# Altium schematic sheet RT_SUPER_C1.SchDoc
size D; Organization: Altium Limited; Address1: 3 Minna Close; Address2: Belrose; Address3: NSW 2085; Address4: Australia; SheetNumber: 1; SheetTotal: 1; PAGE_TITLE: -
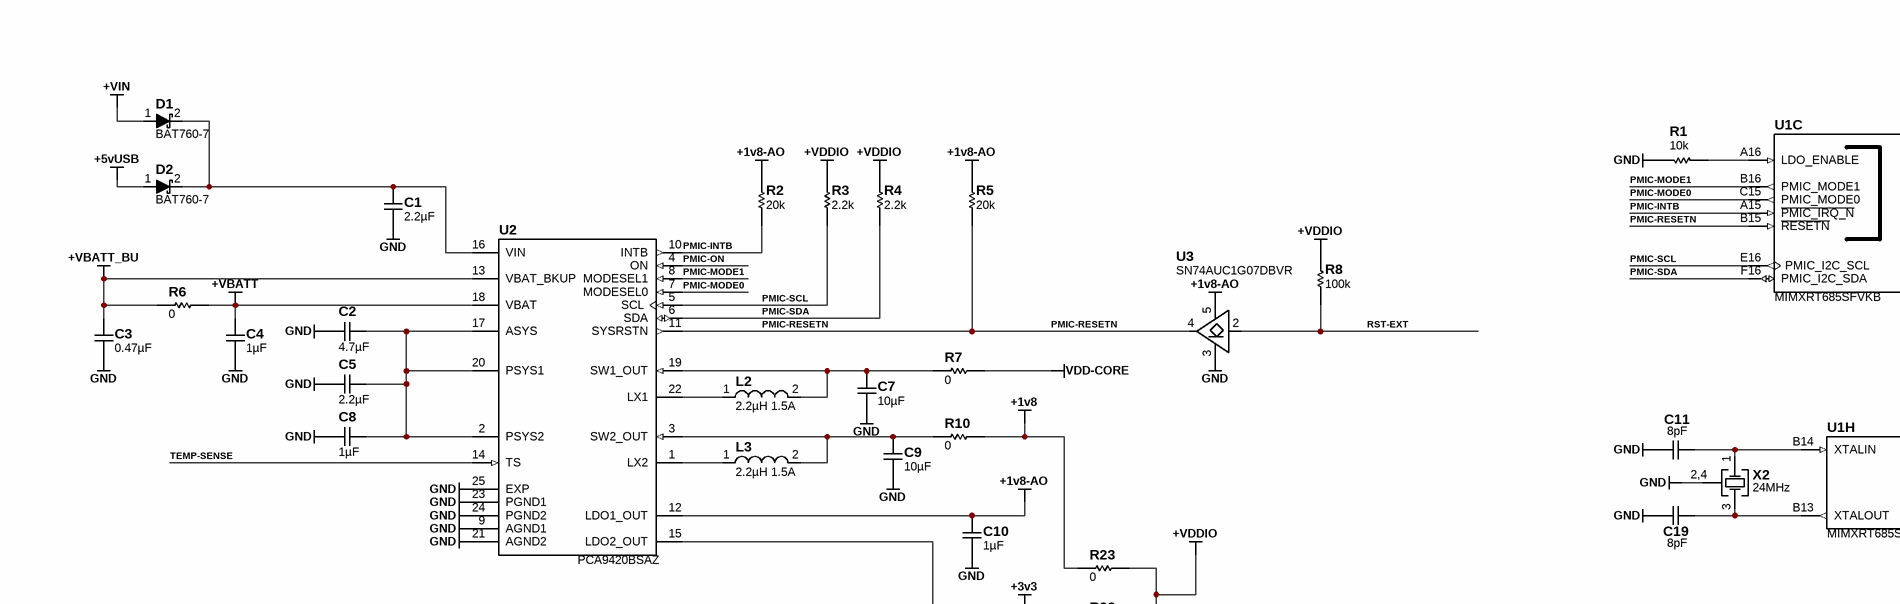
[diagram p0: RT_SUPER_C1.SchDoc, top left]
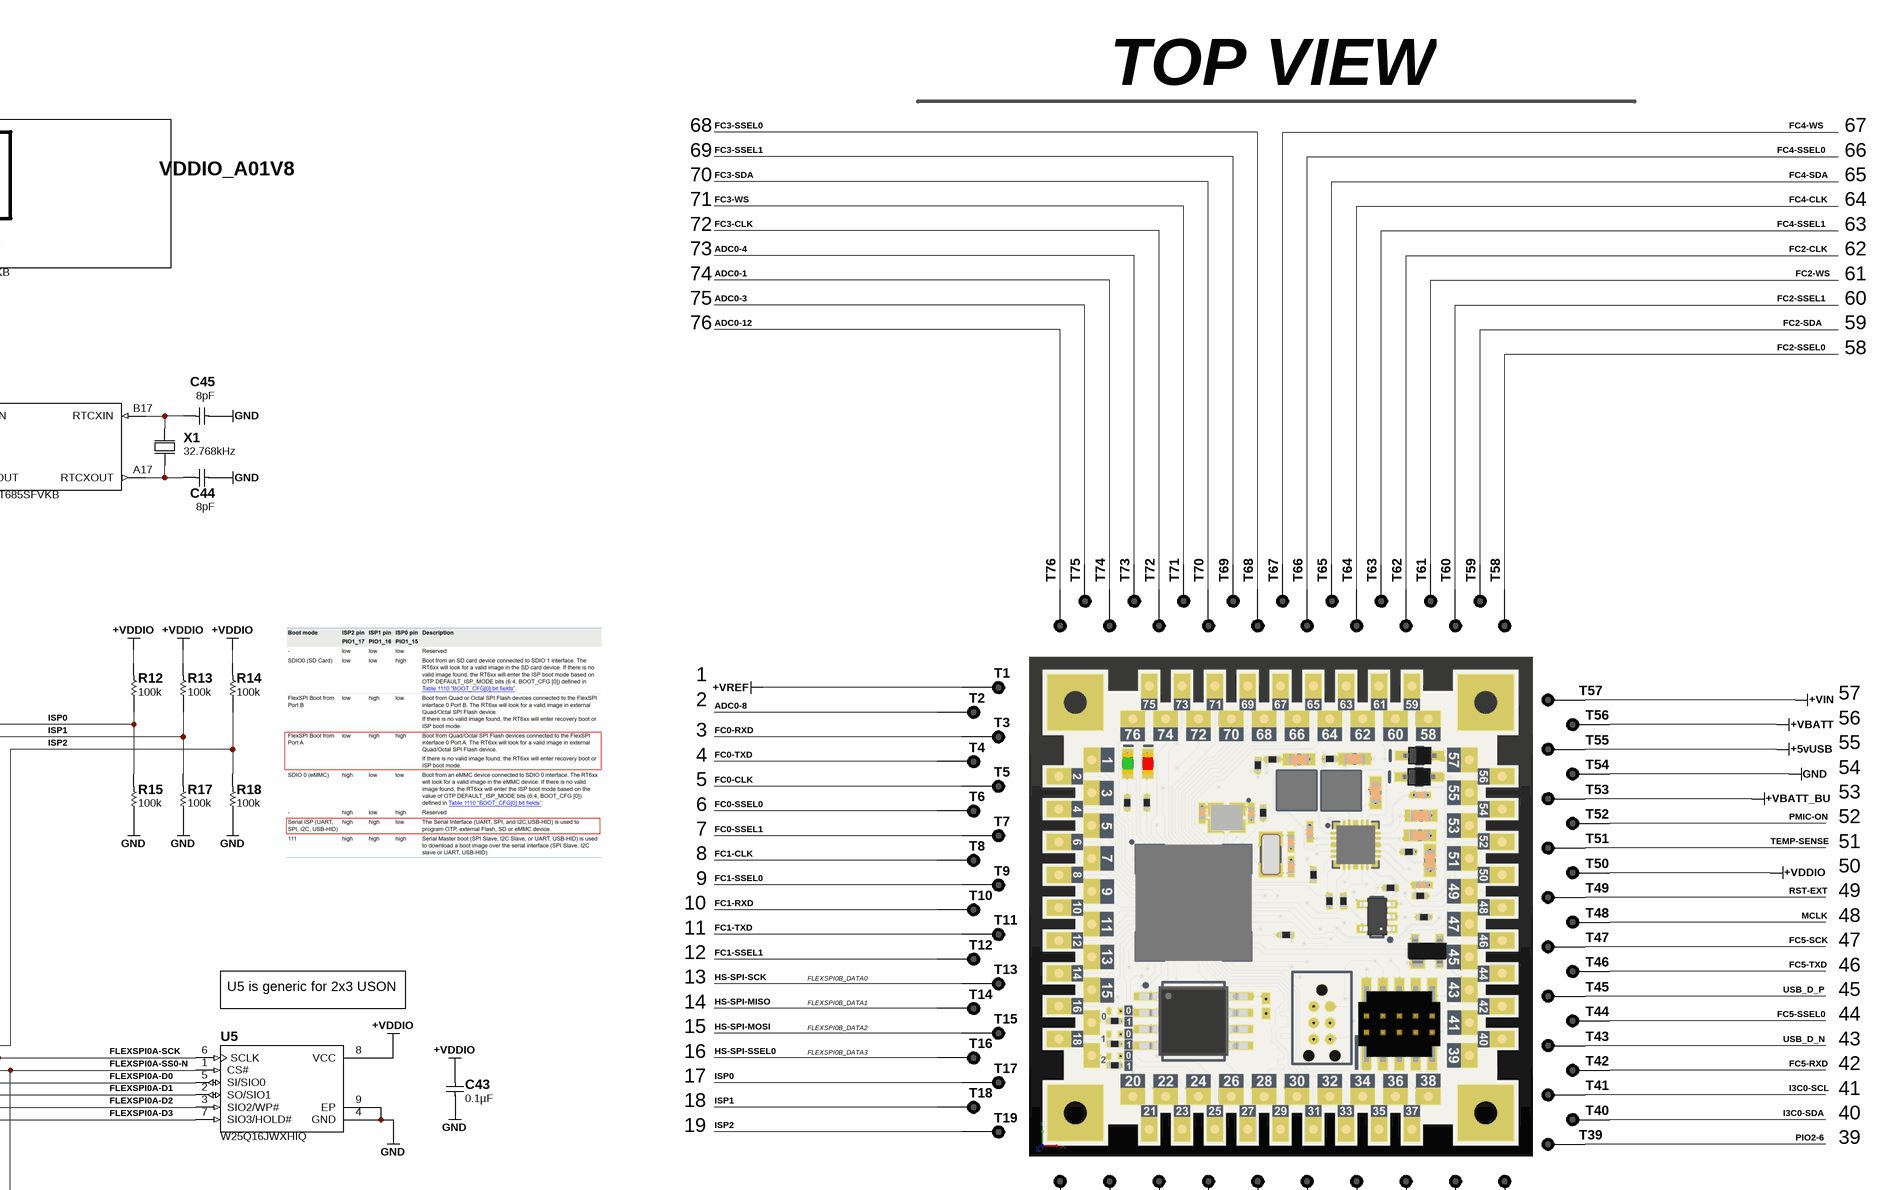
[diagram p1: RT_SUPER_C1.SchDoc, top right]
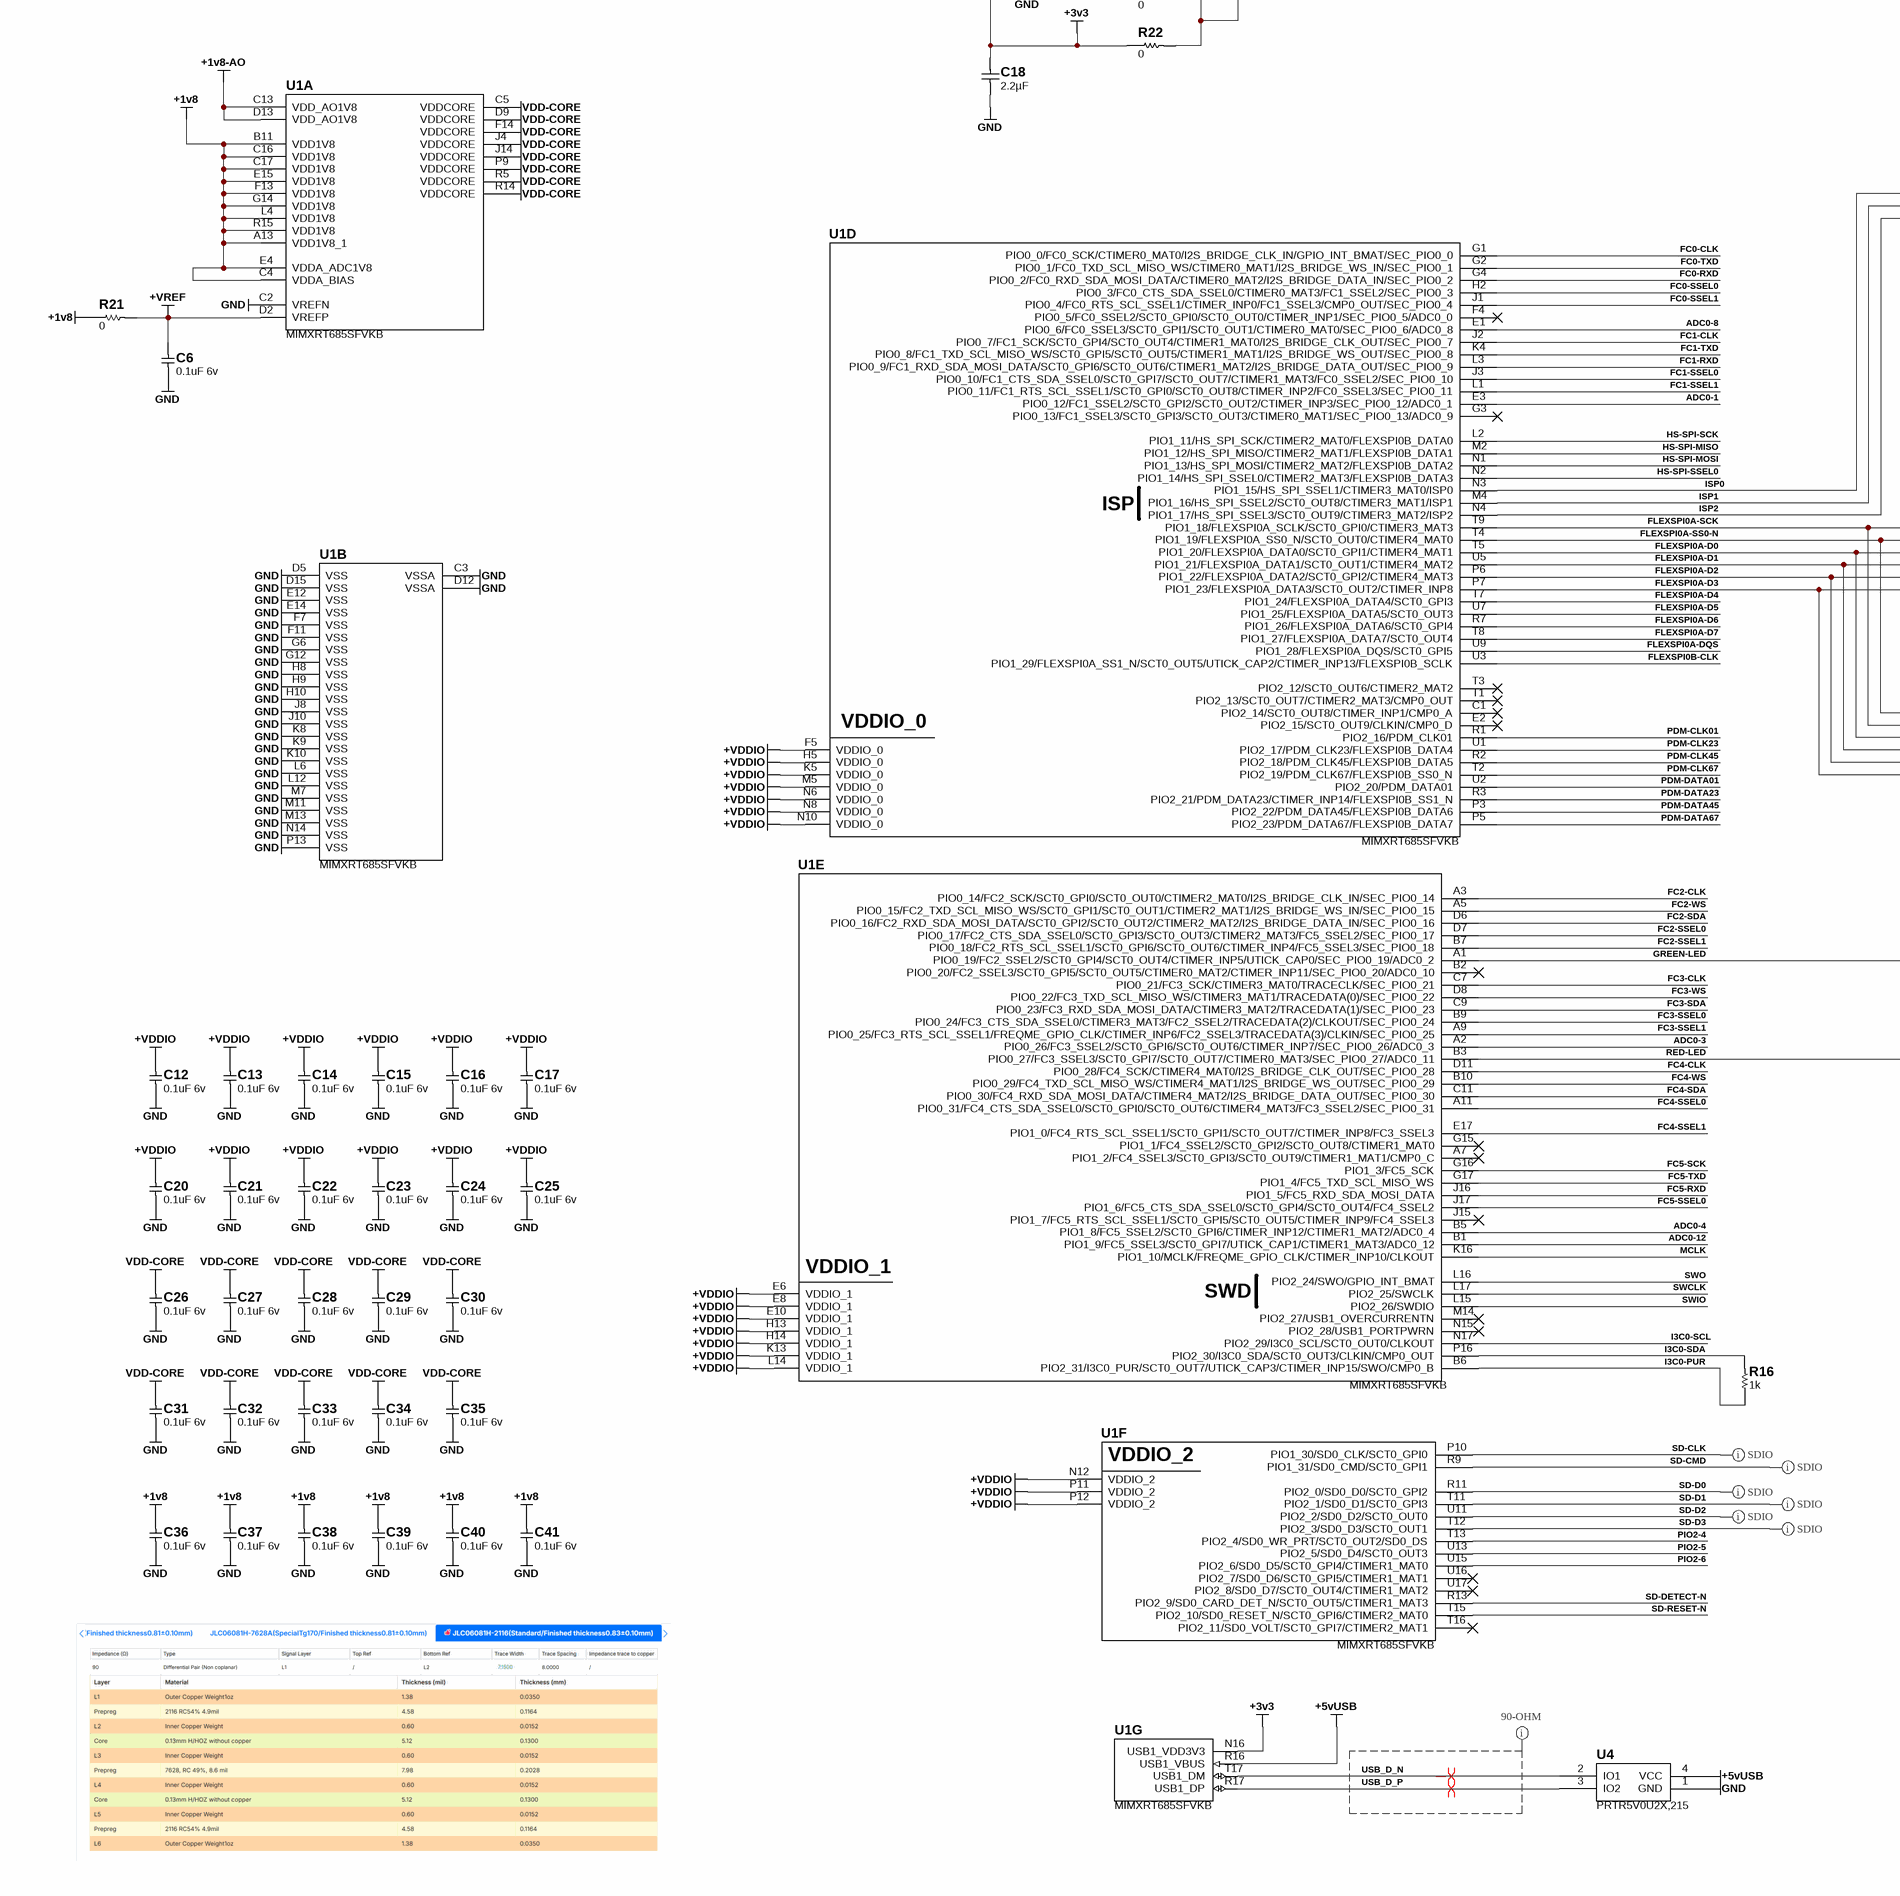
[diagram p2: RT_SUPER_C1.SchDoc, bottom left]
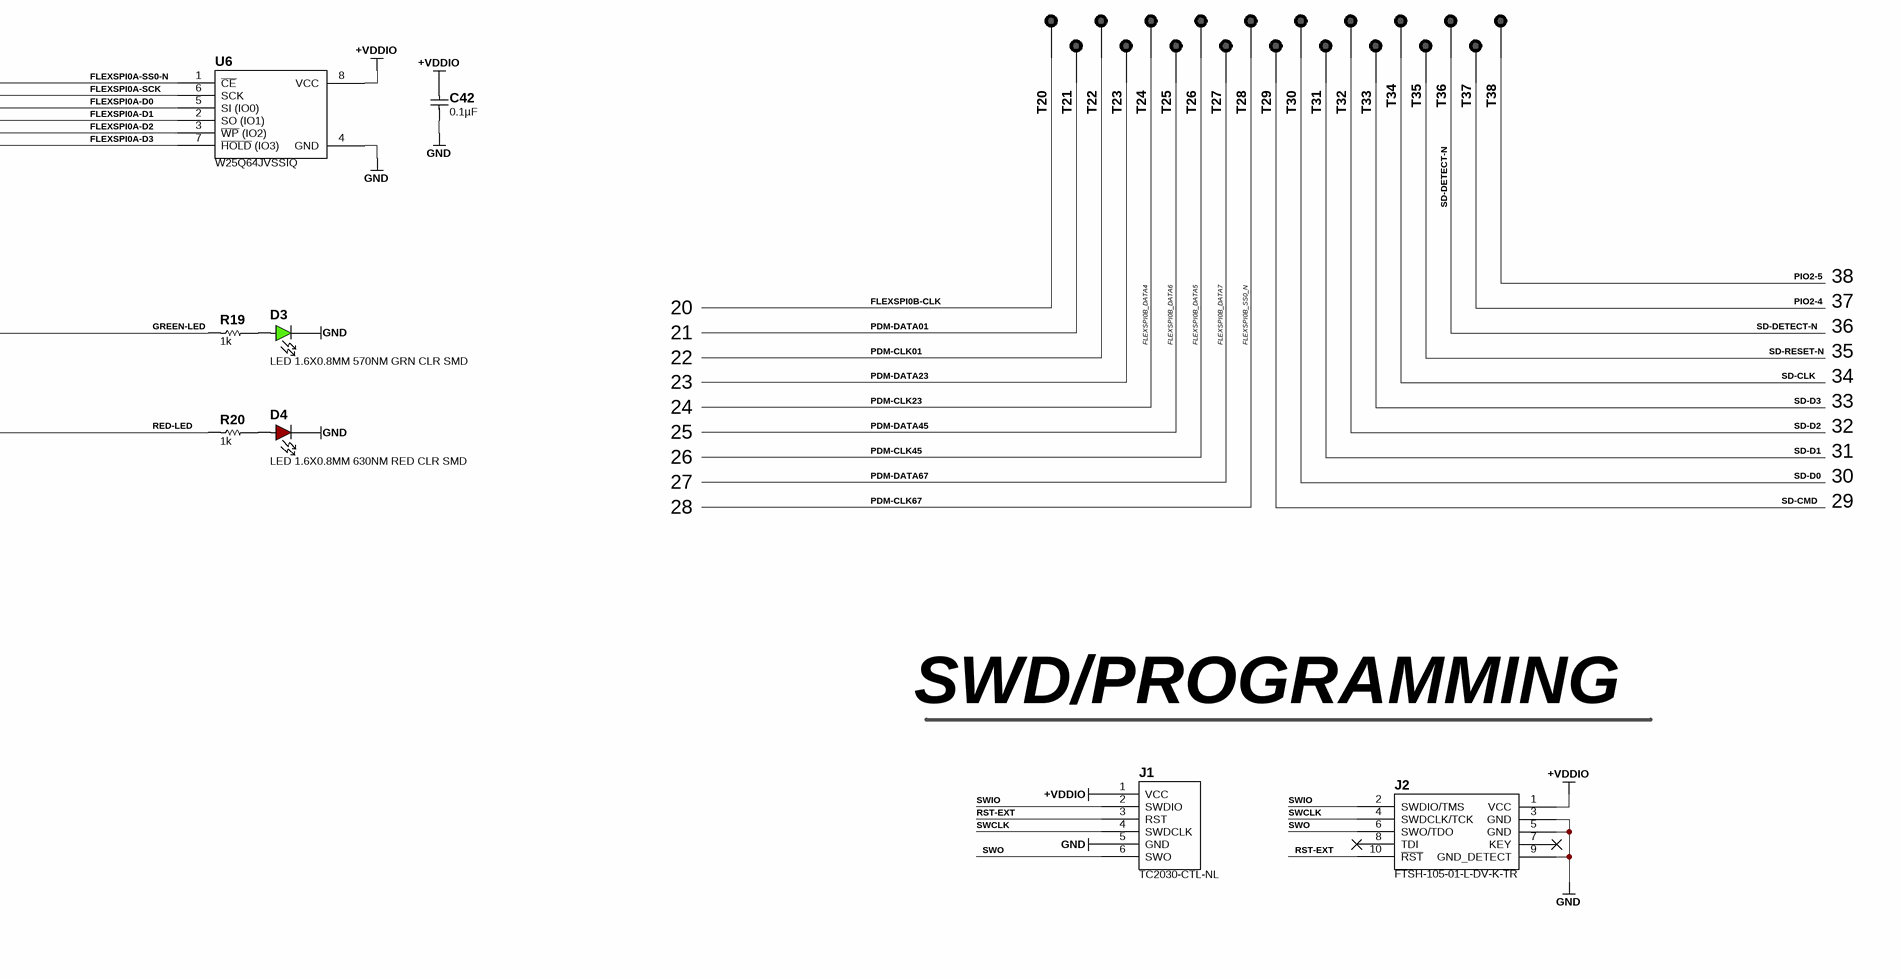
[diagram p3: RT_SUPER_C1.SchDoc, bottom right]

## Parts
C1  2.2µF  [C0603_0.90MM_MD]
C2  4.7µF  [C0603_1.00MM_MD]
C3  0.47µF  [C0402_0.55MM_HD]
C4  1µF  [C0402_0.55MM_HD]
C5  2.2µF  [C0603_0.90MM_MD]
C6  0.1uF 6v  [C0201_PERFECT]
C7  10µF  [C0603_0.90MM_MD]
C8  1µF  [C0402_0.55MM_HD]
C9  10µF  [C0603_0.90MM_MD]
C10  1µF  [C0402_0.55MM_HD]
C11  8pF  [C0402_0.55MM_HD]
C12  0.1uF 6v  [C0201_PERFECT]
C13  0.1uF 6v  [C0201_PERFECT]
C14  0.1uF 6v  [C0201_PERFECT]
C15  0.1uF 6v  [C0201_PERFECT]
C16  0.1uF 6v  [C0201_PERFECT]
C17  0.1uF 6v  [C0201_PERFECT]
C18  2.2µF  [C0603_0.90MM_MD]
C19  8pF  [C0402_0.55MM_HD]
C20  0.1uF 6v  [C0201_PERFECT]
C21  0.1uF 6v  [C0201_PERFECT]
C22  0.1uF 6v  [C0201_PERFECT]
C23  0.1uF 6v  [C0201_PERFECT]
C24  0.1uF 6v  [C0201_PERFECT]
C25  0.1uF 6v  [C0201_PERFECT]
C26  0.1uF 6v  [C0201_PERFECT]
C27  0.1uF 6v  [C0201_PERFECT]
C28  0.1uF 6v  [C0201_PERFECT]
C29  0.1uF 6v  [C0201_PERFECT]
C30  0.1uF 6v  [C0201_PERFECT]
C31  0.1uF 6v  [C0201_PERFECT]
C32  0.1uF 6v  [C0201_PERFECT]
C33  0.1uF 6v  [C0201_PERFECT]
C34  0.1uF 6v  [C0201_PERFECT]
C35  0.1uF 6v  [C0201_PERFECT]
C36  0.1uF 6v  [C0201_PERFECT]
C37  0.1uF 6v  [C0201_PERFECT]
C38  0.1uF 6v  [C0201_PERFECT]
C39  0.1uF 6v  [C0201_PERFECT]
C40  0.1uF 6v  [C0201_PERFECT]
C41  0.1uF 6v  [C0201_PERFECT]
C42  0.1µF  [C0402_0.55MM_MD]
C43  0.1µF  [C0402_0.55MM_MD]
C44  8pF  [C0402_0.55MM_HD]
C45  8pF  [C0402_0.55MM_HD]
D1  BAT760-7  [D_SOD-323_P]
D2  BAT760-7  [D_SOD-323_P]
D3  LED 1.6X0.8MM 570NM GRN CLR SMD  [LED_0603 - GREEN]
D4  LED 1.6X0.8MM 630NM RED CLR SMD  [LED_0603 - RED]
J1  TC2030‐CTL‐NL  [TC2030 NO LATCH]  (no BOM)
J2  FTSH-105-01-L-DV-K-TR  [FTSH-105-01-L-DV-K-TR]
L2  2.2µH 1.5A  [L_NRH3012]
L3  2.2µH 1.5A  [L_NRH3012]
R1  10k  [R0402_0.40MM_HD]
R2  20k  [R0402_0.40MM_HD]
R3  2.2k  [R0402_0.40MM_HD]
R4  2.2k  [R0402_0.40MM_HD]
R5  20k  [R0402_0.40MM_HD]
R6  0  [R0402_0.40MM_HD]
R7  0  [R0402_0.40MM_HD]
R8  100k  [R0402_0.40MM_HD]
R10  0  [R0402_0.40MM_HD]
R12  100k  [R0402_0.40MM_HD]
R13  100k  [R0402_0.40MM_HD]
R14  100k  [R0402_0.40MM_HD]
R15  100k  [R0402_0.40MM_HD]
R16  1k  [R0402_0.40MM_HD]
R17  100k  [R0402_0.40MM_HD]
R18  100k  [R0402_0.40MM_HD]
R19  1k  [R0402_0.40MM_HD]
R20  1k  [R0402_0.40MM_HD]
R21  0  [R0402_0.40MM_HD]
R22  0  [R0402_0.40MM_HD]
R23  0  [R0402_0.40MM_HD]
T1  SOLDER_HOLE  [MACHINE_PIN_SOLDERHOLE]  (value not drawn)  (no BOM)
T2  SOLDER_HOLE  [MACHINE_PIN_SOLDERHOLE]  (value not drawn)  (no BOM)
T3  SOLDER_HOLE  [MACHINE_PIN_SOLDERHOLE]  (value not drawn)  (no BOM)
T4  SOLDER_HOLE  [MACHINE_PIN_SOLDERHOLE]  (value not drawn)  (no BOM)
T5  SOLDER_HOLE  [MACHINE_PIN_SOLDERHOLE]  (value not drawn)  (no BOM)
T6  SOLDER_HOLE  [MACHINE_PIN_SOLDERHOLE]  (value not drawn)  (no BOM)
T7  SOLDER_HOLE  [MACHINE_PIN_SOLDERHOLE]  (value not drawn)  (no BOM)
T8  SOLDER_HOLE  [MACHINE_PIN_SOLDERHOLE]  (value not drawn)  (no BOM)
T9  SOLDER_HOLE  [MACHINE_PIN_SOLDERHOLE]  (value not drawn)  (no BOM)
T10  SOLDER_HOLE  [MACHINE_PIN_SOLDERHOLE]  (value not drawn)  (no BOM)
T11  SOLDER_HOLE  [MACHINE_PIN_SOLDERHOLE]  (value not drawn)  (no BOM)
T12  SOLDER_HOLE  [MACHINE_PIN_SOLDERHOLE]  (value not drawn)  (no BOM)
T13  SOLDER_HOLE  [MACHINE_PIN_SOLDERHOLE]  (value not drawn)  (no BOM)
T14  SOLDER_HOLE  [MACHINE_PIN_SOLDERHOLE]  (value not drawn)  (no BOM)
T15  SOLDER_HOLE  [MACHINE_PIN_SOLDERHOLE]  (value not drawn)  (no BOM)
T16  SOLDER_HOLE  [MACHINE_PIN_SOLDERHOLE]  (value not drawn)  (no BOM)
T17  SOLDER_HOLE  [MACHINE_PIN_SOLDERHOLE]  (value not drawn)  (no BOM)
T18  SOLDER_HOLE  [MACHINE_PIN_SOLDERHOLE]  (value not drawn)  (no BOM)
T19  SOLDER_HOLE  [MACHINE_PIN_SOLDERHOLE]  (value not drawn)  (no BOM)
T20  SOLDER_HOLE  [MACHINE_PIN_SOLDERHOLE]  (value not drawn)  (no BOM)
T21  SOLDER_HOLE  [MACHINE_PIN_SOLDERHOLE]  (value not drawn)  (no BOM)
T22  SOLDER_HOLE  [MACHINE_PIN_SOLDERHOLE]  (value not drawn)  (no BOM)
T23  SOLDER_HOLE  [MACHINE_PIN_SOLDERHOLE]  (value not drawn)  (no BOM)
T24  SOLDER_HOLE  [MACHINE_PIN_SOLDERHOLE]  (value not drawn)  (no BOM)
T25  SOLDER_HOLE  [MACHINE_PIN_SOLDERHOLE]  (value not drawn)  (no BOM)
T26  SOLDER_HOLE  [MACHINE_PIN_SOLDERHOLE]  (value not drawn)  (no BOM)
T27  SOLDER_HOLE  [MACHINE_PIN_SOLDERHOLE]  (value not drawn)  (no BOM)
T28  SOLDER_HOLE  [MACHINE_PIN_SOLDERHOLE]  (value not drawn)  (no BOM)
T29  SOLDER_HOLE  [MACHINE_PIN_SOLDERHOLE]  (value not drawn)  (no BOM)
T30  SOLDER_HOLE  [MACHINE_PIN_SOLDERHOLE]  (value not drawn)  (no BOM)
T31  SOLDER_HOLE  [MACHINE_PIN_SOLDERHOLE]  (value not drawn)  (no BOM)
T32  SOLDER_HOLE  [MACHINE_PIN_SOLDERHOLE]  (value not drawn)  (no BOM)
T33  SOLDER_HOLE  [MACHINE_PIN_SOLDERHOLE]  (value not drawn)  (no BOM)
T34  SOLDER_HOLE  [MACHINE_PIN_SOLDERHOLE]  (value not drawn)  (no BOM)
T35  SOLDER_HOLE  [MACHINE_PIN_SOLDERHOLE]  (value not drawn)  (no BOM)
T36  SOLDER_HOLE  [MACHINE_PIN_SOLDERHOLE]  (value not drawn)  (no BOM)
T37  SOLDER_HOLE  [MACHINE_PIN_SOLDERHOLE]  (value not drawn)  (no BOM)
T38  SOLDER_HOLE  [MACHINE_PIN_SOLDERHOLE]  (value not drawn)  (no BOM)
T39  SOLDER_HOLE  [MACHINE_PIN_SOLDERHOLE]  (value not drawn)  (no BOM)
T40  SOLDER_HOLE  [MACHINE_PIN_SOLDERHOLE]  (value not drawn)  (no BOM)
T41  SOLDER_HOLE  [MACHINE_PIN_SOLDERHOLE]  (value not drawn)  (no BOM)
T42  SOLDER_HOLE  [MACHINE_PIN_SOLDERHOLE]  (value not drawn)  (no BOM)
T43  SOLDER_HOLE  [MACHINE_PIN_SOLDERHOLE]  (value not drawn)  (no BOM)
T44  SOLDER_HOLE  [MACHINE_PIN_SOLDERHOLE]  (value not drawn)  (no BOM)
T45  SOLDER_HOLE  [MACHINE_PIN_SOLDERHOLE]  (value not drawn)  (no BOM)
T46  SOLDER_HOLE  [MACHINE_PIN_SOLDERHOLE]  (value not drawn)  (no BOM)
T47  SOLDER_HOLE  [MACHINE_PIN_SOLDERHOLE]  (value not drawn)  (no BOM)
T48  SOLDER_HOLE  [MACHINE_PIN_SOLDERHOLE]  (value not drawn)  (no BOM)
T49  SOLDER_HOLE  [MACHINE_PIN_SOLDERHOLE]  (value not drawn)  (no BOM)
T50  SOLDER_HOLE  [MACHINE_PIN_SOLDERHOLE]  (value not drawn)  (no BOM)
T51  SOLDER_HOLE  [MACHINE_PIN_SOLDERHOLE]  (value not drawn)  (no BOM)
T52  SOLDER_HOLE  [MACHINE_PIN_SOLDERHOLE]  (value not drawn)  (no BOM)
T53  SOLDER_HOLE  [MACHINE_PIN_SOLDERHOLE]  (value not drawn)  (no BOM)
T54  SOLDER_HOLE  [MACHINE_PIN_SOLDERHOLE]  (value not drawn)  (no BOM)
T55  SOLDER_HOLE  [MACHINE_PIN_SOLDERHOLE]  (value not drawn)  (no BOM)
T56  SOLDER_HOLE  [MACHINE_PIN_SOLDERHOLE]  (value not drawn)  (no BOM)
T57  SOLDER_HOLE  [MACHINE_PIN_SOLDERHOLE]  (value not drawn)  (no BOM)
T58  SOLDER_HOLE  [MACHINE_PIN_SOLDERHOLE]  (value not drawn)  (no BOM)
T59  SOLDER_HOLE  [MACHINE_PIN_SOLDERHOLE]  (value not drawn)  (no BOM)
T60  SOLDER_HOLE  [MACHINE_PIN_SOLDERHOLE]  (value not drawn)  (no BOM)
T61  SOLDER_HOLE  [MACHINE_PIN_SOLDERHOLE]  (value not drawn)  (no BOM)
T62  SOLDER_HOLE  [MACHINE_PIN_SOLDERHOLE]  (value not drawn)  (no BOM)
T63  SOLDER_HOLE  [MACHINE_PIN_SOLDERHOLE]  (value not drawn)  (no BOM)
T64  SOLDER_HOLE  [MACHINE_PIN_SOLDERHOLE]  (value not drawn)  (no BOM)
T65  SOLDER_HOLE  [MACHINE_PIN_SOLDERHOLE]  (value not drawn)  (no BOM)
T66  SOLDER_HOLE  [MACHINE_PIN_SOLDERHOLE]  (value not drawn)  (no BOM)
T67  SOLDER_HOLE  [MACHINE_PIN_SOLDERHOLE]  (value not drawn)  (no BOM)
T68  SOLDER_HOLE  [MACHINE_PIN_SOLDERHOLE]  (value not drawn)  (no BOM)
T69  SOLDER_HOLE  [MACHINE_PIN_SOLDERHOLE]  (value not drawn)  (no BOM)
T70  SOLDER_HOLE  [MACHINE_PIN_SOLDERHOLE]  (value not drawn)  (no BOM)
T71  SOLDER_HOLE  [MACHINE_PIN_SOLDERHOLE]  (value not drawn)  (no BOM)
T72  SOLDER_HOLE  [MACHINE_PIN_SOLDERHOLE]  (value not drawn)  (no BOM)
T73  SOLDER_HOLE  [MACHINE_PIN_SOLDERHOLE]  (value not drawn)  (no BOM)
T74  SOLDER_HOLE  [MACHINE_PIN_SOLDERHOLE]  (value not drawn)  (no BOM)
T75  SOLDER_HOLE  [MACHINE_PIN_SOLDERHOLE]  (value not drawn)  (no BOM)
T76  SOLDER_HOLE  [MACHINE_PIN_SOLDERHOLE]  (value not drawn)  (no BOM)
U1  MIMXRT685SFVKB  [VFBGA176]  (parts A,B,C,D,E,F,G,H of 8)
U2  PCA9420BSAZ  [PCA9420]
U3  SN74AUC1G07DBVR  [SOT23-5]
U4  PRTR5V0U2X,215  [SOT143B]
U5  W25Q16JWXHIQ  [W25Q_XSON_8]
U6  W25Q64JVSSIQ  [SOIC127P830X200-8L]
X1  32.768kHz  [XTAL_3215]
X2  24MHz  [XTAL-2.5x2.0mm]

## Nets
+1v8: C36.2 C37.2 C38.2 C39.2 C40.2 C41.2 R10.2 R21.1 R23.1 U1.A13(VDD1V8_1) U1.B11(VDD1V8) U1.C4(VDDA_BIAS) U1.C16(VDD1V8) U1.C17(VDD1V8) U1.E4(VDDA_ADC1V8) U1.E15(VDD1V8) U1.F13(VDD1V8) U1.G14(VDD1V8) U1.L4(VDD1V8) U1.R15(VDD1V8)
+1v8-AO: C10.2 R2.2 R5.2 U1.C13(VDD_AO1V8) U1.D13(VDD_AO1V8) U2.12(LDO1_OUT) U3.5(VCC)
+3v3: C18.2 R22.1 U1.N16(USB1_VDD3V3) U2.15(LDO2_OUT)
+5vUSB: D2.1(A) T55.1 U1.R16(USB1_VBUS) U4.4(VCC)
+VBATT: C4.2 R6.2 T56.1 U2.18(VBAT)
+VBATT_BU: C3.2 R6.1 T53.1 U2.13(VBAT_BKUP)
+VDDIO: C12.2 C13.2 C14.2 C15.2 C16.2 C17.2 C20.2 C21.2 C22.2 C23.2 C24.2 C25.2 C42.1 C43.1 J1.1(VCC) J2.1(VCC) R3.2 R4.2 R8.2 R12.2 R13.2 R14.2 R22.2 R23.2 T50.1 U1.E6(VDDIO_1) U1.E8(VDDIO_1) U1.E10(VDDIO_1) U1.F5(VDDIO_0) U1.H5(VDDIO_0) U1.H13(VDDIO_1) U1.H14(VDDIO_1) U1.K5(VDDIO_0) U1.K13(VDDIO_1) U1.L14(VDDIO_1) U1.M5(VDDIO_0) U1.N6(VDDIO_0) U1.N8(VDDIO_0) U1.N10(VDDIO_0) U1.N12(VDDIO_2) U1.P11(VDDIO_2) U1.P12(VDDIO_2) U5.8(VCC) U6.8(VCC)
+VIN: D1.1(A) T57.1
+VREF: C6.2 R21.2 T1.1 U1.D2(VREFP)
GND: C1.1 C2.2 C3.1 C4.1 C5.2 C6.1 C7.1 C8.2 C9.1 C10.1 C11.1 C12.1 C13.1 C14.1 C15.1 C16.1 C17.1 C18.1 C19.1 C20.1 C21.1 C22.1 C23.1 C24.1 C25.1 C26.1 C27.1 C28.1 C29.1 C30.1 C31.1 C32.1 C33.1 C34.1 C35.1 C36.1 C37.1 C38.1 C39.1 C40.1 C41.1 C42.2 C43.2 C44.2 C45.2 D3.C D4.C J1.5(GND) J2.3(GND) J2.5(GND) J2.9(GND_DETECT) R1.1 R15.1 R17.1 R18.1 T54.1 U1.C2(VREFN) U1.C3(VSSA) U1.D5(VSS) U1.D12(VSSA) U1.D15(VSS) U1.E12(VSS) U1.E14(VSS) U1.F7(VSS) U1.F11(VSS) U1.G6(VSS) U1.G12(VSS) U1.H8(VSS) U1.H9(VSS) U1.H10(VSS) U1.J8(VSS) U1.J10(VSS) U1.K8(VSS) U1.K9(VSS) U1.K10(VSS) U1.L6(VSS) U1.L12(VSS) U1.M7(VSS) U1.M11(VSS) U1.M13(VSS) U1.N14(VSS) U1.P13(VSS) U2.9(AGND1) U2.21(AGND2) U2.23(PGND1) U2.24(PGND2) U2.25(EXP) U3.3(GND) U4.1(GND) U5.4(GND) U5.9(EP) U6.4(GND) X2.2,4(OSC1)
VDD-CORE: C26.2 C27.2 C28.2 C29.2 C30.2 C31.2 C32.2 C33.2 C34.2 C35.2 R7.2 U1.C5(VDDCORE) U1.D9(VDDCORE) U1.F14(VDDCORE) U1.J4(VDDCORE) U1.J14(VDDCORE) U1.P9(VDDCORE) U1.R5(VDDCORE) U1.R14(VDDCORE)
ADC0-1: T74.1 U1.E3(PIO0_12/FC1_SSEL2/SCT0_GPI2/SCT0_OUT2/CTIMER_INP3/SEC_PIO0_12/ADC0_1)
ADC0-3: T75.1 U1.A2(PIO0_26/FC3_SSEL2/SCT0_GPI6/SCT0_OUT6/CTIMER_INP7/SEC_PIO0_26/ADC0_3)
ADC0-4: T73.1 U1.B5(PIO1_8/FC5_SSEL2/SCT0_GPI6/CTIMER_INP12/CTIMER1_MAT2/ADC0_4)
ADC0-8: T2.1 U1.E1(PIO0_6/FC0_SSEL3/SCT0_GPI1/SCT0_OUT1/CTIMER0_MAT0/SEC_PIO0_6/ADC0_8)
ADC0-12: T76.1 U1.B1(PIO1_9/FC5_SSEL3/SCT0_GPI7/UTICK_CAP1/CTIMER1_MAT3/ADC0_12)
FC0-CLK: T5.1 U1.G1(PIO0_0/FC0_SCK/CTIMER0_MAT0/I2S_BRIDGE_CLK_IN/GPIO_INT_BMAT/SEC_PIO0_0)
FC0-RXD: T3.1 U1.G4(PIO0_2/FC0_RXD_SDA_MOSI_DATA/CTIMER0_MAT2/I2S_BRIDGE_DATA_IN/SEC_PIO0_2)
FC0-SSEL0: T6.1 U1.H2(PIO0_3/FC0_CTS_SDA_SSEL0/CTIMER0_MAT3/FC1_SSEL2/SEC_PIO0_3)
FC0-SSEL1: T7.1 U1.J1(PIO0_4/FC0_RTS_SCL_SSEL1/CTIMER_INP0/FC1_SSEL3/CMP0_OUT/SEC_PIO0_4)
FC0-TXD: T4.1 U1.G2(PIO0_1/FC0_TXD_SCL_MISO_WS/CTIMER0_MAT1/I2S_BRIDGE_WS_IN/SEC_PIO0_1)
FC1-CLK: T8.1 U1.J2(PIO0_7/FC1_SCK/SCT0_GPI4/SCT0_OUT4/CTIMER1_MAT0/I2S_BRIDGE_CLK_OUT/SEC_PIO0_7)
FC1-RXD: T10.1 U1.L3(PIO0_9/FC1_RXD_SDA_MOSI_DATA/SCT0_GPI6/SCT0_OUT6/CTIMER1_MAT2/I2S_BRIDGE_DATA_OUT/SEC_PIO0_9)
FC1-SSEL0: T9.1 U1.J3(PIO0_10/FC1_CTS_SDA_SSEL0/SCT0_GPI7/SCT0_OUT7/CTIMER1_MAT3/FC0_SSEL2/SEC_PIO0_10)
FC1-SSEL1: T12.1 U1.L1(PIO0_11/FC1_RTS_SCL_SSEL1/SCT0_GPI0/SCT0_OUT8/CTIMER_INP2/FC0_SSEL3/SEC_PIO0_11)
FC1-TXD: T11.1 U1.K4(PIO0_8/FC1_TXD_SCL_MISO_WS/SCT0_GPI5/SCT0_OUT5/CTIMER1_MAT1/I2S_BRIDGE_WS_OUT/SEC_PIO0_8)
FC2-CLK: T62.1 U1.A3(PIO0_14/FC2_SCK/SCT0_GPI0/SCT0_OUT0/CTIMER2_MAT0/I2S_BRIDGE_CLK_IN/SEC_PIO0_14)
FC2-SDA: T59.1 U1.D6(PIO0_16/FC2_RXD_SDA_MOSI_DATA/SCT0_GPI2/SCT0_OUT2/CTIMER2_MAT2/I2S_BRIDGE_DATA_IN/SEC_PIO0_16)
FC2-SSEL0: T58.1 U1.D7(PIO0_17/FC2_CTS_SDA_SSEL0/SCT0_GPI3/SCT0_OUT3/CTIMER2_MAT3/FC5_SSEL2/SEC_PIO0_17)
FC2-SSEL1: T60.1 U1.B7(PIO0_18/FC2_RTS_SCL_SSEL1/SCT0_GPI6/SCT0_OUT6/CTIMER_INP4/FC5_SSEL3/SEC_PIO0_18)
FC2-WS: T61.1 U1.A5(PIO0_15/FC2_TXD_SCL_MISO_WS/SCT0_GPI1/SCT0_OUT1/CTIMER2_MAT1/I2S_BRIDGE_WS_IN/SEC_PIO0_15)
FC3-CLK: T72.1 U1.C7(PIO0_21/FC3_SCK/CTIMER3_MAT0/TRACECLK/SEC_PIO0_21)
FC3-SDA: T70.1 U1.C9(PIO0_23/FC3_RXD_SDA_MOSI_DATA/CTIMER3_MAT2/TRACEDATA(1)/SEC_PIO0_23)
FC3-SSEL0: T68.1 U1.B9(PIO0_24/FC3_CTS_SDA_SSEL0/CTIMER3_MAT3/FC2_SSEL2/TRACEDATA(2)/CLKOUT/SEC_PIO0_24)
FC3-SSEL1: T69.1 U1.A9(PIO0_25/FC3_RTS_SCL_SSEL1/FREQME_GPIO_CLK/CTIMER_INP6/FC2_SSEL3/TRACEDATA(3)/CLKIN/SEC_PIO0_25)
FC3-WS: T71.1 U1.D8(PIO0_22/FC3_TXD_SCL_MISO_WS/CTIMER3_MAT1/TRACEDATA(0)/SEC_PIO0_22)
FC4-CLK: T64.1 U1.D11(PIO0_28/FC4_SCK/CTIMER4_MAT0/I2S_BRIDGE_CLK_OUT/SEC_PIO0_28)
FC4-SDA: T65.1 U1.C11(PIO0_30/FC4_RXD_SDA_MOSI_DATA/CTIMER4_MAT2/I2S_BRIDGE_DATA_OUT/SEC_PIO0_30)
FC4-SSEL0: T66.1 U1.A11(PIO0_31/FC4_CTS_SDA_SSEL0/SCT0_GPI0/SCT0_OUT6/CTIMER4_MAT3/FC3_SSEL2/SEC_PIO0_31)
FC4-SSEL1: T63.1 U1.E17(PIO1_0/FC4_RTS_SCL_SSEL1/SCT0_GPI1/SCT0_OUT7/CTIMER_INP8/FC3_SSEL3)
FC4-WS: T67.1 U1.B10(PIO0_29/FC4_TXD_SCL_MISO_WS/CTIMER4_MAT1/I2S_BRIDGE_WS_OUT/SEC_PIO0_29)
FC5-RXD: T42.1 U1.J16(PIO1_5/FC5_RXD_SDA_MOSI_DATA)
FC5-SCK: T47.1 U1.G16(PIO1_3/FC5_SCK)
FC5-SSEL0: T44.1 U1.J17(PIO1_6/FC5_CTS_SDA_SSEL0/SCT0_GPI4/SCT0_OUT4/FC4_SSEL2)
FC5-TXD: T46.1 U1.G17(PIO1_4/FC5_TXD_SCL_MISO_WS)
FLEXSPI0A-D0: U1.T5(PIO1_20/FLEXSPI0A_DATA0/SCT0_GPI1/CTIMER4_MAT1) U5.5(SI/SIO0) U6.5(SI_(IO0))
FLEXSPI0A-D1: U1.U5(PIO1_21/FLEXSPI0A_DATA1/SCT0_OUT1/CTIMER4_MAT2) U5.2(SO/SIO1) U6.2(SO_(IO1))
FLEXSPI0A-D2: U1.P6(PIO1_22/FLEXSPI0A_DATA2/SCT0_GPI2/CTIMER4_MAT3) U5.3(SIO2/WP#) U6.3(~{WP}_(IO2))
FLEXSPI0A-D3: U1.P7(PIO1_23/FLEXSPI0A_DATA3/SCT0_OUT2/CTIMER_INP8) U5.7(SIO3/HOLD#) U6.7(~{HOLD}_(IO3))
FLEXSPI0A-D4: U1.T7(PIO1_24/FLEXSPI0A_DATA4/SCT0_GPI3)
FLEXSPI0A-D5: U1.U7(PIO1_25/FLEXSPI0A_DATA5/SCT0_OUT3)
FLEXSPI0A-D6: U1.R7(PIO1_26/FLEXSPI0A_DATA6/SCT0_GPI4)
FLEXSPI0A-D7: U1.T8(PIO1_27/FLEXSPI0A_DATA7/SCT0_OUT4)
FLEXSPI0A-DQS: U1.U9(PIO1_28/FLEXSPI0A_DQS/SCT0_GPI5)
FLEXSPI0A-SCK: U1.T9(PIO1_18/FLEXSPI0A_SCLK/SCT0_GPI0/CTIMER3_MAT3) U5.6(SCLK) U6.6(SCK)
FLEXSPI0A-SS0-N: U1.T4(PIO1_19/FLEXSPI0A_SS0_N/SCT0_OUT0/CTIMER4_MAT0) U5.1(CS#) U6.1(~{CE})
FLEXSPI0B-CLK: T20.1 U1.U3(PIO1_29/FLEXSPI0A_SS1_N/SCT0_OUT5/UTICK_CAP2/CTIMER_INP13/FLEXSPI0B_SCLK)
GREEN-LED: R19.2 U1.A1(PIO0_19/FC2_SSEL2/SCT0_GPI4/SCT0_OUT4/CTIMER_INP5/UTICK_CAP0/SEC_PIO0_19/ADC0_2)
HS-SPI-MISO: T14.1 U1.M2(PIO1_12/HS_SPI_MISO/CTIMER2_MAT1/FLEXSPI0B_DATA1)
HS-SPI-MOSI: T15.1 U1.N1(PIO1_13/HS_SPI_MOSI/CTIMER2_MAT2/FLEXSPI0B_DATA2)
HS-SPI-SCK: T13.1 U1.L2(PIO1_11/HS_SPI_SCK/CTIMER2_MAT0/FLEXSPI0B_DATA0)
HS-SPI-SSEL0: T16.1 U1.N2(PIO1_14/HS_SPI_SSEL0/CTIMER2_MAT3/FLEXSPI0B_DATA3)
I3C0-PUR: R16.1 U1.B6(PIO2_31/I3C0_PUR/SCT0_OUT7/UTICK_CAP3/CTIMER_INP15/SWO/CMP0_B)
I3C0-SCL: T41.1 U1.N17(PIO2_29/I3C0_SCL/SCT0_OUT0/CLKOUT)
I3C0-SDA: R16.2 T40.1 U1.P16(PIO2_30/I3C0_SDA/SCT0_OUT3/CLKIN/CMP0_OUT)
ISP0: R12.1 R15.2 T17.1 U1.N3(PIO1_15/HS_SPI_SSEL1/CTIMER3_MAT0/ISP0)
ISP1: R13.1 R17.2 T18.1 U1.M4(PIO1_16/HS_SPI_SSEL2/SCT0_OUT8/CTIMER3_MAT1/ISP1)
ISP2: R14.1 R18.2 T19.1 U1.N4(PIO1_17/HS_SPI_SSEL3/SCT0_OUT9/CTIMER3_MAT2/ISP2)
MCLK: T48.1 U1.K16(PIO1_10/MCLK/FREQME_GPIO_CLK/CTIMER_INP10/CLKOUT)
PDM-CLK01: T22.1 U1.R1(PIO2_16/PDM_CLK01)
PDM-CLK23: T24.1 U1.U1(PIO2_17/PDM_CLK23/FLEXSPI0B_DATA4)
PDM-CLK45: T26.1 U1.R2(PIO2_18/PDM_CLK45/FLEXSPI0B_DATA5)
PDM-CLK67: T28.1 U1.T2(PIO2_19/PDM_CLK67/FLEXSPI0B_SS0_N)
PDM-DATA01: T21.1 U1.U2(PIO2_20/PDM_DATA01)
PDM-DATA23: T23.1 U1.R3(PIO2_21/PDM_DATA23/CTIMER_INP14/FLEXSPI0B_SS1_N)
PDM-DATA45: T25.1 U1.P3(PIO2_22/PDM_DATA45/FLEXSPI0B_DATA6)
PDM-DATA67: T27.1 U1.P5(PIO2_23/PDM_DATA67/FLEXSPI0B_DATA7)
PIO2-4: T37.1 U1.T13(PIO2_4/SD0_WR_PRT/SCT0_OUT2/SD0_DS)
PIO2-5: T38.1 U1.U13(PIO2_5/SD0_D4/SCT0_OUT3)
PIO2-6: T39.1 U1.U15(PIO2_6/SD0_D5/SCT0_GPI4/CTIMER1_MAT0)
PMIC-INTB: R2.1 U1.A15(~{PMIC_IRQ_N}) U2.10(INTB)
PMIC-MODE0: U1.C15(PMIC_MODE0) U2.7(MODESEL0)
PMIC-MODE1: U1.B16(PMIC_MODE1) U2.8(MODESEL1)
PMIC-ON: T52.1 U2.4(ON)
PMIC-RESETN: R5.1 U1.B15(~{RESETN}) U2.11(SYSRSTN) U3.4(Y)
PMIC-SCL: R3.1 U1.E16(PMIC_I2C_SCL) U2.5(SCL)
PMIC-SDA: R4.1 U1.F16(PMIC_I2C_SDA) U2.6(SDA)
RED-LED: R20.2 U1.B3(PIO0_27/FC3_SSEL3/SCT0_GPI7/SCT0_OUT7/CTIMER0_MAT3/SEC_PIO0_27/ADC0_11)
RST-EXT: J1.3(RST) J2.10(~{RST}) R8.1 T49.1 U3.2(A)
SD-CLK: T34.1 U1.P10(PIO1_30/SD0_CLK/SCT0_GPI0)
SD-CMD: T29.1 U1.R9(PIO1_31/SD0_CMD/SCT0_GPI1)
SD-D0: T30.1 U1.R11(PIO2_0/SD0_D0/SCT0_GPI2)
SD-D1: T31.1 U1.T11(PIO2_1/SD0_D1/SCT0_GPI3)
SD-D2: T32.1 U1.U11(PIO2_2/SD0_D2/SCT0_OUT0)
SD-D3: T33.1 U1.T12(PIO2_3/SD0_D3/SCT0_OUT1)
SD-DETECT-N: T36.1 U1.R13(PIO2_9/SD0_CARD_DET_N/SCT0_OUT5/CTIMER1_MAT3)
SD-RESET-N: T35.1 U1.T15(PIO2_10/SD0_RESET_N/SCT0_GPI6/CTIMER2_MAT0)
SWCLK: J1.4(SWDCLK) J2.4(SWDCLK/TCK) U1.L17(PIO2_25/SWCLK)
SWIO: J1.2(SWDIO) J2.2(SWDIO/TMS) U1.L15(PIO2_26/SWDIO)
SWO: J1.6(SWO) J2.6(SWO/TDO) U1.L16(PIO2_24/SWO/GPIO_INT_BMAT)
TEMP-SENSE: T51.1 U2.14(TS)
USB_D_N: T43.1 U1.T17(USB1_DM) U4.2(IO1)
USB_D_P: T45.1 U1.R17(USB1_DP) U4.3(IO2)
NetC1_2: C1.2 D1.2(K) D2.2(K) U2.16(VIN)
NetC2_1: C2.1 C5.1 C8.1 U2.2(PSYS2) U2.17(ASYS) U2.20(PSYS1)
NetC7_2: C7.2 L2.2 R7.1 U2.19(SW1_OUT)
NetC9_2: C9.2 L3.2 R10.1 U2.3(SW2_OUT)
NetC11_2: C11.2 U1.B14(XTALIN) X2.1(OSC1)
NetC19_2: C19.2 U1.B13(XTALOUT) X2.3(OSC3)
NetC44_1: C44.1 U1.A17(RTCXOUT) X1.1(inp)
NetC45_1: C45.1 U1.B17(RTCXIN) X1.2(out)
NetD3_A: D3.A R19.1
NetD4_A: D4.A R20.1
NetL2_1: L2.1 U2.22(LX1)
NetL3_1: L3.1 U2.1(LX2)
NetR1_2: R1.2 U1.A16(LDO_ENABLE)

Not connected (* = marked no-connect by the designer): J2 7(KEY)* 8(TDI)*; U1 A7(PIO1_2/FC4_SSEL3/SCT0_GPI3/SCT0_OUT9/CTIMER1_MAT1/CMP0_C)* B2(PIO0_20/FC2_SSEL3/SCT0_GPI5/SCT0_OUT5/CTIMER0_MAT2/CTIMER_INP11/SEC_PIO0_20/ADC0_10)* C1(PIO2_14/SCT0_OUT8/CTIMER_INP1/CMP0_A)* E2(PIO2_15/SCT0_OUT9/CLKIN/CMP0_D)* F4(PIO0_5/FC0_SSEL2/SCT0_GPI0/SCT0_OUT0/CTIMER_INP1/SEC_PIO0_5/ADC0_0)* G3(PIO0_13/FC1_SSEL3/SCT0_GPI3/SCT0_OUT3/CTIMER0_MAT1/SEC_PIO0_13/ADC0_9)* G15(PIO1_1/FC4_SSEL2/SCT0_GPI2/SCT0_OUT8/CTIMER1_MAT0)* J15(PIO1_7/FC5_RTS_SCL_SSEL1/SCT0_GPI5/SCT0_OUT5/CTIMER_INP9/FC4_SSEL3)* M14(PIO2_27/USB1_OVERCURRENTN)* N15(PIO2_28/USB1_PORTPWRN)* T1(PIO2_13/SCT0_OUT7/CTIMER2_MAT3/CMP0_OUT)* T3(PIO2_12/SCT0_OUT6/CTIMER2_MAT2)* T16(PIO2_11/SD0_VOLT/SCT0_GPI7/CTIMER2_MAT1)* U16(PIO2_7/SD0_D6/SCT0_GPI5/CTIMER1_MAT1)* U17(PIO2_8/SD0_D7/SCT0_OUT4/CTIMER1_MAT2)*

## Layout directives
differential pair: USB_D_N, USB_D_P
net class SDIO: SD-CLK, SD-CMD, SD-D0, SD-D1, SD-D2, SD-D3
net class 90-OHM: USB_D_N, USB_D_P

## Notes on the sheet
- 68
- TOP VIEW
- 67
- 69
- 70
- 65
- 66
- 71
- 72
- 73
- 62
- 63
- 64
- 74
- 75
- 60
- 61
- 76
- 58
- 59
- 1
- 2
- 3
- 55
- 56
- 57
- 4
- 5
- 53
- 54
- 6
- 7
- 8
- 50
- 51
- 52
- 10
- 9
- 48
- 49
- 11
- 12
- 13
- FLEXSPI0B_DATA0
- 45
- 46
- 47
- U5 is generic for 2x3 USON
- 14
- 15
- FLEXSPI0B_DATA1
- FLEXSPI0B_DATA2
- FLEXSPI0B_DATA3
- 43
- 44
- 16
- 17
- 18
- 40
- 41
- 42
- 19
- 39
- 20
- 36
- 37
- 38
- 21
- 22
- 23
- FLEXSPI0B_DATA4
- FLEXSPI0B_DATA6
- FLEXSPI0B_DATA5
- FLEXSPI0B_DATA7
- FLEXSPI0B_SS0_N
- 34
- 35
- 24
- 25
- 31
- 32
- 33
- 26
- 27
- 28
- 29
- 30
- SWD/PROGRAMMING
- Part Number
- Document Type
- SCHEMATIC DRAWING
- PCB Mixdown
- CCA Mixdown
- Codename
- Engineer
- Date
- Status
- Page
- (in symbol MIMXRT685SFVKB, part C) VDDIO_A01V8
- (in symbol MIMXRT685SFVKB, part D) ISP
- (in symbol MIMXRT685SFVKB, part E) SWD

## Library data of the parts
C1 C5 C18 = GCM188R70J225KE22D: CAP CER 2.2UF 6.3V X7R 0603; manufacturer: Murata Electronics; Tolerance: ±10%; Substitution Notes: 2.2µF , 6.3V , ±10% , X7R , -55°C ~ 125°C , AEC-Q200 , 0603; classification: capacitors/Murata_C0603; id: 019a404f-4691-7d07-43f1-8d708eb8f7ec; kicad-footprint-path: footprints\C0603_0.90MM_MD.kicad_mod; kicad-symbol-path: symbols\C_2P_NP.kicad_sym; Value: 2.2µF; Temperature Coefficient: X7R; Voltage - Rated: 6.3V; Operating Temperature: -55°C ~ 125°C; Ratings: AEC-Q200; Package: 603; Thickness (Max): 0.90MM; cad-reference: GCM188R70J225KE22D; jlc_pn: C126582; kicad-footprint: C0603_0.90MM_MD; kicad-symbol: C_2P_NP; mpn: GCM188R70J225KE22D
C2 = GCJ188C70J475KE02D: CAP CER 4.7UF 6.3V X7S 0603; Manufacturer: Murata Electronics; Tolerance: ±10%; Substitution Notes: 4.7µF , 6.3V , ±10% , X7S , -55°C ~ 125°C , AEC-Q200 , 0603; Value: 4.7µF; Temperature Coefficient: X7S; Manufacturer Part Number: GCJ188C70J475KE02D; ComponentLink1Description: Datasheet (Internal); ComponentLink1URL: https://search.murata.co.jp/Ceramy/image/img/A01X/G101/ENG/GCJ188C70J475KE02-01.pdf; ComponentLink2Description: Datasheet (External); ComponentLink2URL: https://search.murata.co.jp/Ceramy/image/img/A01X/G101/ENG/GCJ188C70J475KE02-01.pdf; Supplier 1: Digikey; Supplier Part Number 1: 490-16480-1-ND; Category: Capacitors; Voltage - Rated: 6.3V; Operating Temperature: -55°C ~ 125°C; Ratings: AEC-Q200; Package: 0603; Thickness (Max): 1.00MM
C3 = GRT155R61E474KE01D: CAP CER 0.47UF 25V X5R 0402; Manufacturer: Murata Electronics; Tolerance: ±10%; Substitution Notes: 0.47µF , 25V , ±10% , X5R , -55°C ~ 85°C , AEC-Q200 , 0402; Value: 0.47µF; Temperature Coefficient: X5R; Manufacturer Part Number: GRT155R61E474KE01D; ComponentLink1Description: Datasheet (Internal); ComponentLink1URL: https://search.murata.co.jp/Ceramy/image/img/A01X/partnumbering_e_02.pdf; ComponentLink2Description: Datasheet (External); ComponentLink2URL: https://search.murata.co.jp/Ceramy/image/img/A01X/partnumbering_e_02.pdf; Supplier 1: Digikey; Supplier Part Number 1: 490-12269-1-ND; Category: Capacitors; Voltage - Rated: 25V; Operating Temperature: -55°C ~ 85°C; Ratings: AEC-Q200; Package: 0402; Thickness (Max): 0.55MM
C4 C8 C10 = GCM155C71A105KE38D: CAP CER 1UF 10V X7S 0402; Manufacturer: Murata Electronics; Tolerance: ±10%; Substitution Notes: 1µF , 10V , ±10% , X7S , -55°C ~ 125°C , AEC-Q200 , 0402; Value: 1µF; Temperature Coefficient: X7S; Manufacturer Part Number: GCM155C71A105KE38D; ComponentLink1Description: Datasheet (Internal); ComponentLink1URL: https://www.murata.com/~/media/webrenewal/support/library/catalog/products/capacitor/mlcc/c03e.ashx?la=en-us; ComponentLink2Description: Datasheet (External); ComponentLink2URL: https://www.murata.com/~/media/webrenewal/support/library/catalog/products/capacitor/mlcc/c03e.ashx?la=en-us; Supplier 1: Digikey; Supplier Part Number 1: 490-13409-1-ND; Category: Capacitors; Voltage - Rated: 10V; Operating Temperature: -55°C ~ 125°C; Ratings: AEC-Q200; Package: 0402; Thickness (Max): 0.55MM
C6 C12-C17 C20-C41 = CC0201KRX5R5BB104: Cap Ceramic 0.1uF 6.3VDC X5R 10% SMD 0201 Paper T/R; Manufacturer: Yageo; Capacitance: 100nF; Voltage Rating: 6.3V; Value: 0.1uF 6v; Manufacturer Part Number: CC0201KRX5R5BB104; ComponentLink1Description: https://datasheet.ciiva.com/176/mlccorderingcode-176765.pdf?src-supplier=Digi-Key; ComponentLink1URL: https://datasheet.ciiva.com/176/mlccorderingcode-176765.pdf?src-supplier=Digi-Key; ComponentLink2Description: https://datasheet.ciiva.com/176/mlccorderingcode-176766.pdf?src-supplier=Digi-Key; ComponentLink2URL: https://datasheet.ciiva.com/176/mlccorderingcode-176766.pdf?src-supplier=Digi-Key; Supplier 1: Digi-Key; Supplier Part Number 1: 311-1408-1-ND; Category: Ceramic Capacitors; Tolerance: 10%; RoHS: Yes; Stock: 2999877; Pricing: 1=0.10000, 10=0.02400, 50=0.01340, 100=0.01090, 500=0.00776, 1000=0.00610, 2500=0.00555, 5000=0.00510 (USD); Mount: Surface Mount; Case/Package: 0201; Number of Pins: 2; Case Code (Imperial): 0201; Case Code (Metric): 0603; Min Operating Temperature: -55°C; Max Operating Temperature: 85°C; Dielectric: X5R; Packaging: Tape and Reel; Package Quantity: 1; Voltage Rating (DC): 6.3V; Termination: SMD/SMT; Resistor Type: Ceramic; Series: CC; Length: 0.6mm; Width: 0.3mm; Height: 0.3mm; Thickness: 0.013inch; Depth: 0.3mm; REACH SVHC: No SVHC; Lead Free: Lead Free; Halogen Free: Halogen Free; RoHS Compliant: Yes; ComponentLink3URL: https://datasheet.ciiva.com/176/mlccorderingcode-176767.pdf?src-supplier=Digi-Key; ComponentLink3Description: https://datasheet.ciiva.com/176/mlccorderingcode-176767.pdf?src-supplier=Digi-Key; ComponentLink4URL: https://datasheet.ciiva.com/28450/1359354-28450200.pdf?src-supplier=Element14; ComponentLink4Description: https://datasheet.ciiva.com/28450/1359354-28450200.pdf?src-supplier=Element14; ComponentLink5URL: https://datasheet.ciiva.com/7656/1525783-7656597.pdf?src-supplier=Element14; ComponentLink5Description: https://datasheet.ciiva.com/7656/1525783-7656597.pdf?src-supplier=Element14
C7 C9 = GRT188R61A106ME13D: CAP CER 10UF 10V X5R 0603; Manufacturer: Murata Electronics; Tolerance: ±20%; Substitution Notes: 10µF , 10V , ±20% , X5R , -55°C ~ 85°C , AEC-Q200 , 0603; Value: 10µF; Temperature Coefficient: X5R; Manufacturer Part Number: GRT188R61A106ME13D; ComponentLink1Description: Datasheet (Internal); ComponentLink1URL: https://search.murata.co.jp/Ceramy/image/img/A01X/G101/ENG/GRT188R61A106ME13-01.pdf; ComponentLink2Description: Datasheet (External); ComponentLink2URL: https://search.murata.co.jp/Ceramy/image/img/A01X/G101/ENG/GRT188R61A106ME13-01.pdf; Supplier 1: Digikey; Supplier Part Number 1: 490-12312-1-ND; Category: Capacitors; Voltage - Rated: 10V; Operating Temperature: -55°C ~ 85°C; Ratings: AEC-Q200; Package: 0603; Thickness (Max): 0.90MM
C11 C19 C44 C45 = GCM1555C1H8R0DA16D: CAP CER 8PF 50V C0G/NP0 0402; manufacturer: Murata Electronics; Substitution Notes: 8pF , 50V , ±0.5pF , C0G, NP0 , -55°C ~ 125°C , AEC-Q200 , 0402; Temperature Coefficient: C0G, NP0; Tolerance: ±0.5pF; classification: capacitors/Murata_C0402; id: 019a404f-4218-7c53-d35c-d6453855ed4c; kicad-footprint: C0402_0.55MM_MD; kicad-footprint-path: footprints\C0402_0.55MM_MD.kicad_mod; kicad-symbol-path: symbols\C_2P_NP.kicad_sym; ComponentLink1Description: Datasheet (Internal); ComponentLink1URL: https://www.murata.com/~/media/webrenewal/support/library/catalog/products/capacitor/mlcc/c03e.ashx?la=en-us; ComponentLink2Description: Datasheet (External); ComponentLink2URL: https://www.murata.com/~/media/webrenewal/support/library/catalog/products/capacitor/mlcc/c03e.ashx?la=en-us; Operating Temperature: -55°C ~ 125°C; Package: 402; Ratings: AEC-Q200; Supplier 1: Digikey; Supplier Part Number 1: 490-13294-1-ND; Thickness (Max): 0.55MM; Voltage - Rated: 50V; cad-reference: GCM1555C1H8R0DA16D; kicad-symbol: C_2P_NP; mpn: GCM1555C1H8R0DA16D; Value: 8pF
C42 C43 = CGA2B1X7R1C104K050BC: CAP CER 0.1UF 16V X7R 0402; Manufacturer: TDK Corporation; Tolerance: ±10%; Substitution Notes: 0.1µF , 16V , ±10% , X7R , -55°C ~ 125°C , AEC-Q200 , 0402; Value: 0.1µF; Temperature Coefficient: X7R; Manufacturer Part Number: CGA2B1X7R1C104K050BC; ComponentLink1Description: Datasheet (Internal); ComponentLink1URL: datasheets\TDK\mlcc_automotive_general_en.pdf; ComponentLink2Description: Datasheet (External); ComponentLink2URL: https://product.tdk.com/info/en/catalog/datasheets/mlcc_automotive_general_en.pdf; Supplier 1: Digikey; Supplier Part Number 1: 445-5613-1-ND; Category: Capacitors; Voltage - Rated: 16V; Operating Temperature: -55°C ~ 125°C; Ratings: AEC-Q200; Package: 0402; Thickness (Max): 0.55MM; Features: -
D1 D2 = BAT760-7: DIODE SCHOTTKY 30V 1A SOD323; Manufacturer: Diodes Inc; CategorySort: 400; Voltage - Forward (Vf) (Max) @ If: 550mV @ 1A; Speed: Fast Recovery =< 500ns- > 200mA (Io); Current - Reverse Leakage @ Vr: 50µA @ 15V; Capacitance @ Vr- F: 25pF @ 5V- 1MHz; Num Pins: 2; Diode Suffix: 1A_2C; Category: Diodes; Value: BAT760-7; Manufacturer Part Number: BAT760-7; ComponentLink1Description: Internal Datasheet; ComponentLink1URL: http://www.diodes.com/datasheets/ds30498.pdf; ComponentLink2Description: External Datasheet; ComponentLink2URL: http://www.diodes.com/datasheets/ds30498.pdf; Supplier 1: Digi-Key; Supplier Part Number 1: BAT760DICT-ND; SortValue: BAT760-7; Diode Type: Schottky; Voltage - DC Reverse (Vr) (Max): 30V; Current - Average Rectified (Io): 1A; Reverse Recovery Time (trr): -; Mounting Type: Surface Mount; Package: SC-76- SOD-323; Supplier Device Package: SOD-323; Packaging: Cut Tape (CT)
D3 = APT1608CGCK: Manufacturer: Kingbright Corp; Wavelength - Peak: 574nm; Millicandela Rating: 50mcd; Voltage - Forward (Vf) Typ: 2.1V; Viewing Angle: 120°; Color: Green; Current - Test: 20mA; Lens Type: Clear; Lens Style/Size: Rectangle with Flat Top, 1.2mm x 0.8mm; Value: LED 1.6X0.8MM 570NM GRN CLR SMD; Manufacturer Part Number: APT1608CGCK; RoHS: RoHS Compliant; Wavelength - Dominant: 570nm; Size / Dimension: 1.60mm L x 0.80mm W; Package / Case: 0603 (1608 Metric); Mounting Type: Surface Mount; Packaging: Tape & Reel (TR); Supplier 1: Digi-Key; Supplier Part Number 1: 754-1116-1-ND; Category: Optoelectronics; Stock 1: 89450; Pricing 1: 1=0.2, 10=0.153, 25=0.1224, 100=0.1105, 250=0.102, 500=0.0918 (USD); Height: 0.75mm; Luminous Flux @ Current - Test: -; ComponentLink1URL: http://www.us.kingbright.com/images/catalog/SPEC/APT1608CGCK.pdf; ComponentLink1Description: http://www.us.kingbright.com/images/catalog/SPEC/APT1608CGCK.pdf; Supplier 2: Digikey; Supplier Part Number 2: 160-2162-1-ND
D4 = APT1608SURCK: Manufacturer: Kingbright Corp; Current - Test: 20mA; Wavelength - Peak: 650nm; Millicandela Rating: 220mcd; Voltage - Forward (Vf) Typ: 1.95V; Lens Type: Clear; Lens Style/Size: Rectangle, 1.2mm x 0.8mm; Viewing Angle: 120°; Value: LED 1.6X0.8MM 630NM RED CLR SMD; Supplier 1: Digi-Key; Supplier Part Number 1: 754-1123-1-ND; Manufacturer Part Number: APT1608SURCK; RoHS: RoHS Compliant; Category: Optoelectronics; Stock 1: 92099; Pricing 1: 1=0.16, 10=0.116, 25=0.0932, 100=0.0853, 250=0.07752, 500=0.06976, 1000=0.062 (USD); Color: Red; Luminous Flux @ Current - Test: -; Wavelength - Dominant: 630nm; Size / Dimension: 1.60mm L x 0.80mm W; Height: 0.75mm; Package / Case: 0603 (1608 Metric); Mounting Type: Surface Mount; Packaging: Cut Tape (CT); ComponentLink1URL: http://www.us.kingbright.com/images/catalog/SPEC/APT1608SURCK.pdf; ComponentLink1Description: http://www.us.kingbright.com/images/catalog/SPEC/APT1608SURCK.pdf
J1 = TC2030‐CTL‐NL: Tag Connect Pads - No latching Clips - ARM; Value: TC2030‐CTL‐NL
J2 = FTSH-105-01-L-DV-K-TR: 10P 1.27mm 3.4A 2 Surface Mount,Vertical -55℃~+125℃ SMD,P=1.27mm Headers, Male Pins ROHS; manufacturer: Samtec; classification: connector/debug; id: 019a404f-3a14-73a5-034e-ae816e395ea1; kicad-footprint-path: footprints\FTSH-105-01-L-DV-K-TR.kicad_mod; kicad-symbol-path: symbols\CORTEX-DEBUG.kicad_sym; cad-reference: FTSH-105-01-L-DV-K-TR; jlc_pn: C448647; kicad-footprint: FTSH-105-01-L-DV-K-TR; kicad-symbol: CORTEX-DEBUG; mpn: FTSH-105-01-L-DV-K-TR; Value: FTSH-105-01-L-DV-K-TR
L2 L3 = NRH3012T2R2MN: Inductor 2.2µH 1.5A; Manufacturer: Taiyo Yuden; CategorySort: 300; Inductance (uH): 2.2; Tolerance: ±20%; DCR Max (Ohms): 90 mOhm Max; SRF typ (MHz): 78MHz; Isat (A): 1.5; IRMS: 1.37; Shielding: Sheilded; Category: Inductors; Value: 2.2µH 1.5A; Manufacturer Part Number: NRH3012T2R2MN; ComponentLink1Description: External Datasheet; ComponentLink1URL: https://www.yuden.co.jp/productdata/catalog/en/wound04_e.pdf; Sort Value: 2.2_1.5; Sort Value Package: 2.2_1.5_NRH3012; Part Number: NRH3012T2R2MN; Supplier 1: Digikey; Supplier Part Number 1: 587-2589-1-ND; Supplier Unit Price 1: 0.28; Package: NRH3012; Height (mm): 1.2MM; Rating: -
R1 = ERJ-2RKF1002X: RES 10K OHM 1/10W 1% 0402 SMD; Manufacturer: Panasonic Electronic Components; Package Power: 0402  (0.1W); Power (Watts): 0.1W- 1/10W; Temperature Coefficient: ±100ppm/°C; Limiting Element Voltage: 50; Maximum Overload Voltage: 100; Maximum Working Voltage: 31.6V; Substitution Notes: 10k , ±1% , 0402 , AEC-Q200; Value: 10k; Manufacturer Part Number: ERJ-2RKF1002X; ComponentLink1Description: Internal Datasheet; ComponentLink1URL: datasheets\Panasonic Electronic Components\AOA0000CE2.pdf; ComponentLink2Description: External Datasheet; ComponentLink2URL: http://industrial.panasonic.com/www-data/pdf/AOA0000/AOA0000CE2.pdf; Supplier 1: Digi-Key; Supplier Part Number 1: P10.0KLCT-ND; Category: Resistors; Resistance (Ohms): 10k; Composition: Thick Film; Features: -; Tolerance: ±1%; Package: 0402 (1005 Metric); Supplier Package: 0402; Size / Dimension: 0.039" L x 0.020" W (1.00mm x 0.50mm); Height: 0.40MM; Number of Terminations: 2; Packaging: Cut Tape (CT); Sort Value: 10000; Sort Value Package: 402_10000; Ratings: AEC-Q200
R2 R5 = ERJ-2RKF2002X: RES 20K OHM 1/10W 1% 0402 SMD; Manufacturer: Panasonic Electronic Components; Package Power: 0402  (0.1W); Power (Watts): 0.1W- 1/10W; Temperature Coefficient: ±100ppm/°C; Limiting Element Voltage: 50; Maximum Overload Voltage: 100; Maximum Working Voltage: 44.7V; Substitution Notes: 20k , ±1% , 0402 , AEC-Q200; Value: 20k; Manufacturer Part Number: ERJ-2RKF2002X; ComponentLink1Description: Internal Datasheet; ComponentLink1URL: datasheets\Panasonic Electronic Components\AOA0000CE2.pdf; ComponentLink2Description: External Datasheet; ComponentLink2URL: http://industrial.panasonic.com/www-data/pdf/AOA0000/AOA0000CE2.pdf; Supplier 1: Digi-Key; Supplier Part Number 1: P20.0KLCT-ND; Category: Resistors; Resistance (Ohms): 20k; Composition: Thick Film; Features: -; Tolerance: ±1%; Package: 0402 (1005 Metric); Supplier Package: 0402; Size / Dimension: 0.039" L x 0.020" W (1.00mm x 0.50mm); Height: 0.40MM; Number of Terminations: 2; Packaging: Cut Tape (CT); Sort Value: 20000; Sort Value Package: 402_20000; Ratings: AEC-Q200
R3 R4 = ERJ-2RKF2201X: RES 2.2K OHM 1/10W 1% 0402 SMD; Manufacturer: Panasonic Electronic Components; Package Power: 0402  (0.1W); Power (Watts): 0.1W- 1/10W; Temperature Coefficient: ±100ppm/°C; Limiting Element Voltage: 50; Maximum Overload Voltage: 100; Maximum Working Voltage: 14.8V; Substitution Notes: 2.2k , ±1% , 0402 , AEC-Q200; Value: 2.2k; Manufacturer Part Number: ERJ-2RKF2201X; ComponentLink1Description: Internal Datasheet; ComponentLink1URL: datasheets\Panasonic Electronic Components\AOA0000CE2.pdf; ComponentLink2Description: External Datasheet; ComponentLink2URL: http://industrial.panasonic.com/www-data/pdf/AOA0000/AOA0000CE2.pdf; Supplier 1: Digi-Key; Supplier Part Number 1: P2.20KLCT-ND; Category: Resistors; Resistance (Ohms): 2.2k; Composition: Thick Film; Features: -; Tolerance: ±1%; Package: 0402 (1005 Metric); Supplier Package: 0402; Size / Dimension: 0.039" L x 0.020" W (1.00mm x 0.50mm); Height: 0.40MM; Number of Terminations: 2; Packaging: Cut Tape (CT); Sort Value: 2200; Sort Value Package: 402_2200; Ratings: AEC-Q200
R6 R7 R10 R21-R23 = ERJ-2GE0R00X: RES 0.0 OHM 1/10W JUMP 0402 SMD; Manufacturer: Panasonic Electronic Components; Package Power: 0402  (0.1W); Power (Watts): 0.1W- 1/10W; Tolerance: Jumper; Limiting Element Voltage: 50; Maximum Overload Voltage: 100; Maximum Working Voltage: 0.0V; Substitution Notes: 0 , Jumper , 0402 , AEC-Q200; Value: 0; Manufacturer Part Number: ERJ-2GE0R00X; ComponentLink1Description: Internal Datasheet; ComponentLink1URL: datasheets\Panasonic Electronic Components\AOA0000CE1.pdf; ComponentLink2Description: External Datasheet; ComponentLink2URL: http://industrial.panasonic.com/www-data/pdf/AOA0000/AOA0000CE1.pdf; Supplier 1: Digi-Key; Supplier Part Number 1: P0.0JCT-ND; Category: Resistors; Resistance (Ohms): 0; Composition: Thick Film; Features: -; Temperature Coefficient: -; Package: 0402 (1005 Metric); Supplier Package: 0402; Size / Dimension: 0.039" L x 0.020" W (1.00mm x 0.50mm); Height: 0.40MM; Number of Terminations: 2; Sort Value: 0; Sort Value Package: 402_0; Ratings: AEC-Q200
R8 R12-R15 R17 R18 = ERJ-2RKF1003X: RES 100K OHM 1/10W 1% 0402 SMD; Manufacturer: Panasonic Electronic Components; Package Power: 0402  (0.1W); Power (Watts): 0.1W- 1/10W; Temperature Coefficient: ±100ppm/°C; Limiting Element Voltage: 50; Maximum Overload Voltage: 100; Maximum Working Voltage: 50.0V; Substitution Notes: 100k , ±1% , 0402 , AEC-Q200; Value: 100k; Manufacturer Part Number: ERJ-2RKF1003X; ComponentLink1Description: Internal Datasheet; ComponentLink1URL: datasheets\Panasonic Electronic Components\AOA0000CE2.pdf; ComponentLink2Description: External Datasheet; ComponentLink2URL: http://industrial.panasonic.com/www-data/pdf/AOA0000/AOA0000CE2.pdf; Supplier 1: Digi-Key; Supplier Part Number 1: P100KLCT-ND; Category: Resistors; Resistance (Ohms): 100k; Composition: Thick Film; Features: -; Tolerance: ±1%; Package: 0402 (1005 Metric); Supplier Package: 0402; Size / Dimension: 0.039" L x 0.020" W (1.00mm x 0.50mm); Height: 0.40MM; Number of Terminations: 2; Packaging: Cut Tape (CT); Sort Value: 100000; Sort Value Package: 402_100000; Ratings: AEC-Q200
R16 R19 R20 = ERJ-2RKF1001X: RES 1K OHM 1/10W 1% 0402 SMD; Manufacturer: Panasonic Electronic Components; Package Power: 0402  (0.1W); Power (Watts): 0.1W- 1/10W; Temperature Coefficient: ±100ppm/°C; Limiting Element Voltage: 50; Maximum Overload Voltage: 100; Maximum Working Voltage: 10.0V; Substitution Notes: 1k , ±1% , 0402 , AEC-Q200; Value: 1k; Manufacturer Part Number: ERJ-2RKF1001X; ComponentLink1Description: Internal Datasheet; ComponentLink1URL: datasheets\Panasonic Electronic Components\AOA0000CE2.pdf; ComponentLink2Description: External Datasheet; ComponentLink2URL: http://industrial.panasonic.com/www-data/pdf/AOA0000/AOA0000CE2.pdf; Supplier 1: Digi-Key; Supplier Part Number 1: P1.00KLCT-ND; Category: Resistors; Resistance (Ohms): 1k; Composition: Thick Film; Features: -; Tolerance: ±1%; Package: 0402 (1005 Metric); Supplier Package: 0402; Size / Dimension: 0.039" L x 0.020" W (1.00mm x 0.50mm); Height: 0.40MM; Number of Terminations: 2; Packaging: Cut Tape (CT); Sort Value: 1000; Sort Value Package: 402_1000; Ratings: AEC-Q200
U1 = MIMXRT685SFVKB: SOC i.MX ARM Cortex M33 176-Pin VFBGA Tray; Manufacturer: NXP Semiconductors; Manufacturer Part Number: MIMXRT685SFVKB; Package: None; Availability: Warning; Value: MIMXRT685SFVKB; SnapEDA_Link: https://www.snapeda.com/parts/MIMXRT633SFVKB/Nexperia/view-part/5163781/?ref=snap; Price: None; Check_prices: https://www.snapeda.com/parts/MIMXRT633SFVKB/Nexperia/view-part/5163781/?ref=eda; Purchase-URL: https://pricing.snapeda.com/search/part/MIMXRT633SFVKB/?ref=eda
U2 = PCA9420BSAZ: Power Management IC for Low-Power Microcontroller Applications 24-Pin HVQFN; Manufacturer: NXP Semiconductors; Check_prices: https://www.snapeda.com/parts/PCA9420BSAZ/NXP%20Semiconductors/view-part/5003095/?ref=eda; SnapEDA_Link: https://www.snapeda.com/parts/PCA9420BSAZ/NXP%20Semiconductors/view-part/5003095/?ref=snap; Value: *; Supplier 1: Mouser; Supplier Part Number 1: 771-PCA9420BSAZ; Manufacturer Part Number: PCA9420BSAZ; RoHS: Yes; Stock: 953; Pricing: 1=3.09000, 10=2.78000, 50=2.63000, 100=2.28000, 1000=2.23000, 10000=2.20000 (USD); RoHS Compliant: Yes
U3 = SN74AUC1G07DBVR: IC BUFF NON-INVERT 2.7 V SOT23-5; Manufacturer: Texas Instruments; Max Supply Voltage: 2.7V; Min Supply Voltage: 800mV; Propagation Delay: 1.7ns; Logic Function: Buffer,Inverting; Number of Elements: 1; Low Level Output Current: 9mA; Polarity: Non-Inverting; Turn-On Delay Time: 3.3ns; Quiescent Current: 10uA; Value: SN74AUC1G07DBVR; Supplier 1: Digi-Key; Supplier Part Number 1: 296-12463-1-ND; Manufacturer Part Number: SN74AUC1G07DBVR; RoHS: Yes; Category: Buffers, Drivers and Transceivers; Stock: 6487; Pricing: 1=0.41000, 10=0.32900, 25=0.30080, 100=0.22390, 250=0.20288, 500=0.16790, 1000=0.12593 (USD); Mount: Surface Mount; Case/Package: SOT-23-5; Number of Pins: 5; Min Operating Temperature: -40°C; Max Operating Temperature: 85°C; Packaging: Tape and Reel; Package Quantity: 3000; Number of Channels: 1; Number of Inputs: 1; Number of Outputs: 1; Number of Bits per Element: 1; Number of Input Lines: 1; Number of Output Lines: 1; Number of Gates: 1; Number of Bits: 1; Series: 74AUC; Technology: CMOS; High Level Output Current: 9mA; Radiation Hardening: No; Lead Free: Lead Free; RoHS Compliant: Yes; REACH SVHC: Unknown; ComponentLink1URL: https://datasheet.ciiva.com/1833/sn74auc1g07-1833760.pdf?src-supplier=Digi-Key; ComponentLink1Description: https://datasheet.ciiva.com/1833/sn74auc1g07-1833760.pdf?src-supplier=Digi-Key; ComponentLink2URL: https://datasheet.ciiva.com/14302/sces373q-14302179.pdf?src-supplier=Avnet; ComponentLink2Description: https://datasheet.ciiva.com/14302/sces373q-14302179.pdf?src-supplier=Avnet; ComponentLink3URL: https://datasheet.ciiva.com/15094/getdatasheetpartid-69632-15094449.pdf?src-supplier=Verical; ComponentLink3Description: https://datasheet.ciiva.com/15094/getdatasheetpartid-69632-15094449.pdf?src-supplier=Verical; ComponentLink4URL: https://datasheet.ciiva.com/1833/sn74auc1g07-1833761.pdf?src-supplier=Digi-Key; ComponentLink4Description: https://datasheet.ciiva.com/1833/sn74auc1g07-1833761.pdf?src-supplier=Digi-Key; ComponentLink5URL: https://datasheet.ciiva.com/1833/sn74auc1g07-1833762.pdf?src-supplier=Digi-Key; ComponentLink5Description: https://datasheet.ciiva.com/1833/sn74auc1g07-1833762.pdf?src-supplier=Digi-Key; ComponentLink6URL: https://datasheet.ciiva.com/14302/sces373q-14302175.pdf?src-supplier=Avnet; ComponentLink6Description: https://datasheet.ciiva.com/14302/sces373q-14302175.pdf?src-supplier=Avnet
U4 = PRTR5V0U2X,215: TVS DIODE 5.5VWM SOT143B; Manufacturer: NXP Semiconductors; Bidirectional Channels: 2; Voltage - Reverse Standoff (Typ): 5.5V (Max); Voltage - Breakdown (Min): 6V; Power Line Protection: Yes; Capacitance @ Frequency: 1pF @ 1MHz; Supplier 1: Digi-Key; Supplier Part Number 1: 568-4140-1-ND; Manufacturer Part Number: PRTR5V0U2X,215; RoHS: RoHS Compliant; Category: Circuit Protection; Stock: 11734; Pricing: 1=0.57, 10=0.477, 25=0.418, 100=0.3578, 250=0.31036, 500=0.26286, 1000=0.20265 (USD); Packaging: Cut Tape (CT); Type: Steering (Rail to Rail); Unidirectional Channels: -; Voltage - Clamping (Max) @ Ipp: -; Current - Peak Pulse (10/1000µs): -; Power - Peak Pulse: -; Applications: General Purpose; Operating Temperature: -40°C ~ 85°C (TA); Mounting Type: Surface Mount; Package / Case: TO-253-4, TO-253AA; Supplier Device Package: SOT-143B; ComponentLink1URL: http://www.nxp.com/documents/data_sheet/PRTR5V0U2X.pdf; ComponentLink1Description: http://www.nxp.com/documents/data_sheet/PRTR5V0U2X.pdf; Value: PRTR5V0U2X,215
U5 = W25Q16JWXHIQ: 16Mbit 1.65V~1.95V 133MHz SPI XSON-8-EP(2x3) Memory (ICs) ROHS; Manufacturer: Winbond; kicad-symbol-path: symbols\ic\flash-memory\W25QXX-USON.kicad_sym; kicad-symbol: W25QXX-USON; kicad-footprint-path: footprints\ic\W25Q_XSON_8.kicad_mod; table: flash_memory; Value: W25Q16JWXHIQ; category: ic; Manufacturer Part Number: W25Q16JWXHIQ; cad-reference: W25Q16JWXHIQ; kicad-footprint: W25Q_XSON_8; JLCPCB Part #: C2835333
U6 = W25Q64JWSSIQ: 64Mbit 1V8 SOIC-8-208mil NOR FLASH ROHS; manufacturer: Winbond; classification: ic/flash_memory; id: 019cf8db-ceaa-7e46-b4d4-a7dc12e95b9b; kicad-footprint-path: footprints\SOIC127P830X200-8L.kicad_mod; kicad-symbol-path: symbols\W25Q.kicad_sym; cad-reference: W25Q64JWSSIQ; jlc_pn: C2895586; kicad-footprint: SOIC127P830X200-8L; kicad-symbol: W25Q; mpn: W25Q64JWSSIQ; Value: W25Q64JVSSIQ
X1 = NX3215SA-32.768K-STD-MUA-9: CRYSTAL 32.768KHZ 9PF SMD; Manufacturer: NDK; Frequency Tolerance: 20ppm; ESR (Equivalent Series Resistance): 70kR; Value: 32.768kHz; Supplier 1: Digi-Key; Supplier Part Number 1: 644-1155-6-ND; Manufacturer Part Number: NX3215SA-32.768K-STD-MUA-9; Stock 1: 39338; Pricing 1: 1=0.68, 10=0.602, 50=0.5628, 100=0.4974, 500=0.47124, 1000=0.3927 (USD); Mount: Surface Mount; Case/Package: SMD/SMT; Number of Pins: 2; Min Operating Temperature: -40°C; Max Operating Temperature: 85°C; Frequency: 32.768kHz; Package Quantity: 1000; Load Capacitance: 9pF; Packaging: Tape and Reel; Length: 0.126inch; Height: 0.035inch; Width: 0.059inch; Lead Free: Lead Free
X2 = ECS-240-8-36CKM-TR: 8pF SMD2520-4P Crystals ROHS; manufacturer: ECS; classification: crystal_osc/smt; id: 019a404e-952d-7e39-c884-6e495835a3c8; kicad-footprint-path: footprints\XTAL-2.5x2.0mm.kicad_mod; kicad-symbol-path: symbols\CRYSTAL_4P--1-3-GND-2-4.kicad_sym; Value: 24MHz; cad-reference: ECS-240-8-36CKM-TR; jlc_pn: C435195; kicad-footprint: XTAL-2.5x2.0mm; kicad-symbol: CRYSTAL_4P--1-3-GND-2-4; mpn: ECS-240-8-36CKM-TR